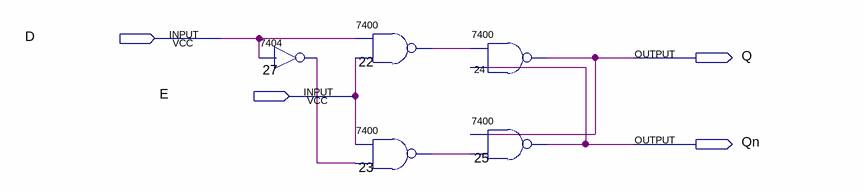
[diagram p0: schematic sheet]
// Quartus schematic Problem5.bdf as structural Verilog: 5 symbols, 4 pins
module Problem5 (
  input  D,
  input  E,
  output Q,
  output Qn
);

  wire n22_1, n23_1, n27_1;

  \7404  u_27 (.\2 (D), .\1 (n27_1));
  \7400  u_22 (.\3 (E), .\2 (D), .\1 (n22_1));
  \7400  u_23 (.\3 (n27_1), .\2 (E), .\1 (n23_1));
  \7400  u_24 (.\3 (Qn), .\2 (n22_1), .\1 (Q));
  \7400  u_25 (.\3 (n23_1), .\2 (Q), .\1 (Qn));
endmodule
